# EAGLE design CMoy-Pro-Battery_Holder-V_1_0_0_1a (EAGLE 6.4)
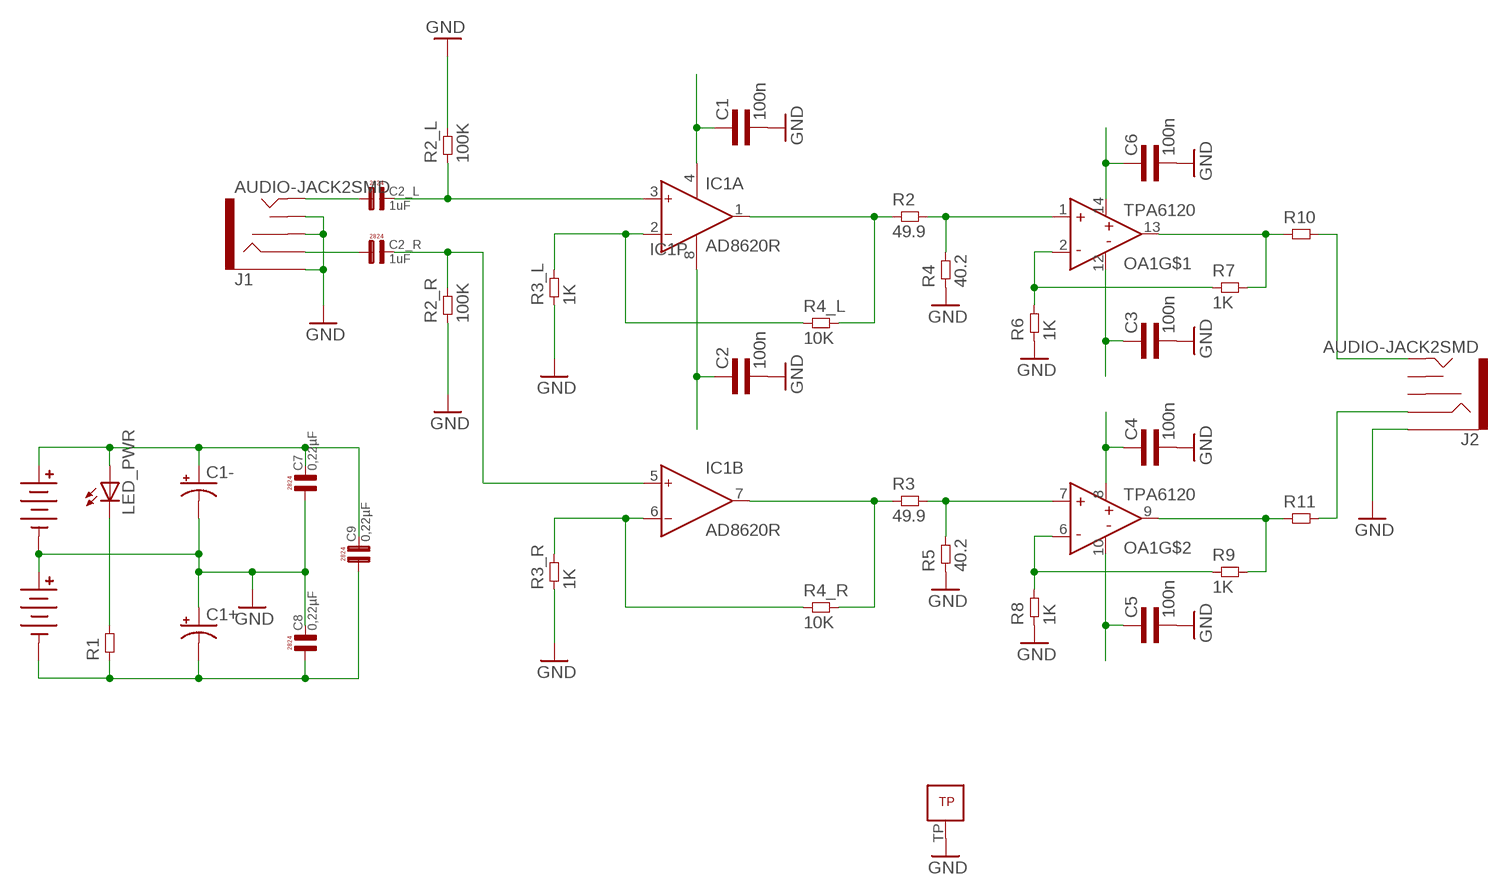
[diagram p0: schematic, sheet 1]

## Parts
BATT1  BATT_9V  [9V_FEMALE]
BATT2  BATT_9V  [9V_FEMALE]
C1  100n  CAP0603L3  [0603L3]
C1+  CPOL-US140CLH-1010  [140CLH-1010]
C1-  CPOL-US140CLH-1010  [140CLH-1010]
C2  100n  CAP0603L3  [0603L3]
C2_L  1uF  1,0µF  [L7,2]
C2_R  1uF  1,0µF  [L7,2]
C3  100n  CAP0603L3  [0603L3]
C4  100n  CAP0603L3  [0603L3]
C5  100n  CAP0603L3  [0603L3]
C6  100n  CAP0603L3  [0603L3]
C7  0,22µF  [L7,2]
C8  0,22µF  [L7,2]
C9  0,22µF  [L7,2]
IC1  AD8620R  [SO8]
J1  AUDIO-JACK2SMD  [AUDIO-JACK-3.5MM-SMD]
J2  AUDIO-JACK2SMD  [AUDIO-JACK-3.5MM-SMD]
LED_PWR  LEDCHIP-LED0603  [CHIP-LED0603]
OA1  TPA6120QFN  [S-PVQFN-N14]
R1  RES0603L3  [0603L3]
R2  49.9  RES0603L3  [0603L3]
R2_L  100K  RES0603L3  [0603L3]
R2_R  100K  RES0603L3  [0603L3]
R3  49.9  RES0603L3  [0603L3]
R3_L  1K  RES0603L3  [0603L3]
R3_R  1K  RES0603L3  [0603L3]
R4  40.2  RES0603L3  [0603L3]
R4_L  10K  RES0603L3  [0603L3]
R4_R  10K  RES0603L3  [0603L3]
R5  40.2  RES0603L3  [0603L3]
R6  1K  RES0603L3  [0603L3]
R7  1K  RES0603L3  [0603L3]
R8  1K  RES0603L3  [0603L3]
R9  1K  RES0603L3  [0603L3]
R10  RES1206L3  [1206L3]
R11  RES1206L3  [1206L3]

## Nets
GND: BATT1.N1(NEG) BATT1.N2(NEG) BATT1.N3(NEG) BATT2.P1(POS) BATT2.P2(POS) BATT2.P3(POS) C1+.+ C1-.- C1.P$2 C2.P$2 C3.P$2 C4.P$2 C5.P$2 C6.P$2 C7.P$1 C8.P$2 J1.RSH J1.SLEEVE J1.TSH J2.SLEEVE OA1.TP R2_L.P$2 R2_R.P$1 R3_L.P$1 R3_R.P$1 R4.P$1 R5.P$1 R6.P$1 R8.P$1
HP_L: C2_R.P$1 J1.RING
HP_R: C2_L.P$1 J1.TIP
IN_L: C2_R.P$2 IC1.5(B:IN+) R2_R.P$2
IN_R: C2_L.P$2 IC1.3(A:IN+) R2_L.P$1
N$1: LED_PWR.C R1.P$2
N$2: OA1.1(IN+) R2.P$2 R4.P$2
N$3: OA1.7(IN+) R3.P$2 R5.P$2
N$4: OA1.2(IN-) R6.P$2 R7.P$1
N$5: IC1.2(A:IN-) R3_L.P$2 R4_L.P$1
N$6: IC1.6(B:IN-) R3_R.P$2 R4_R.P$1
N$7: OA1.13(OUT) R7.P$2 R10.1
N$8: OA1.6(IN-) R8.P$2 R9.P$1
N$9: OA1.9(OUT) R9.P$2 R11.1
N$10: J2.TIP R10.2
N$11: J2.RING R11.2
OUT_L: IC1.1(A:OUT) R2.P$1 R4_L.P$2
OUT_R: IC1.7(B:OUT) R3.P$1 R4_R.P$2
V+: BATT1.P1(POS) BATT1.P2(POS) BATT1.P3(POS) C1-.+ C2.P$1 C4.P$1 C6.P$1 C7.P$2 C9.P$2 IC1.8(P:V+) LED_PWR.A OA1.8(V+) OA1.14(V+)
V-: BATT2.N1(NEG) BATT2.N2(NEG) BATT2.N3(NEG) C1+.- C1.P$1 C3.P$1 C5.P$1 C8.P$1 C9.P$1 IC1.4(P:V-) OA1.10(V-) OA1.12(V-) R1.P$1
Unconnected: J2.RSH J2.TSH

## Library data of the parts
BATT1 BATT2 = common:BATT_9V: 9V Battery
C1-C6 = common:CAP
C1+ C1- = rcl:CPOL-US: POLARIZED CAPACITOR, American symbol
C2_L C2_R = Capacitor-Wima-SMD2824-63v:1,0µF
C7-C9 = Capacitor-Wima-SMD2824-63v:0,22µF
IC1 = analog-devices:AD8620: Precision, Very Low Noise, Low Input Bias Current, Wide Bandwidth JFET Operational Amplifiers Source: http://www.analog.com/static/imported-files/data_sheets/AD8610_8620.pdf; MF: ALTERA CORPORATION; MPN: AD8620ARZ; OC_FARNELL: 9994386; OC_NEWARK: 59K6972
J1 J2 = SparkFun-Connectors:AUDIO-JACK2: Stereo audio jack with bypass switches. Used on LilyPad MP3 board. Production SKU: CONN-10353; PROD_ID: CONN-10353
LED_PWR = adafruit:LED: LED OSRAM: - CHIPLED LG R971, LG N971, LY N971, LG Q971, LY Q971, LO R971, LY R971 LH N974, LH R974 LS Q976, LO Q976, LY Q976 LO Q996 - Hyper CHIPLED LW Q18S LB Q993, LB Q99A, LB R99A - SideLED LS A670, LO A670, LY A670, LG A670, LP A670 LB A673, LV A673, LT A673, LW A673 LH A674 LY A675 LS A676, LA A676, LO A676, LY A676, LW A676 LS A679, LY A679, LG A679 - Hyper Micro SIDELED® LS Y876, LA Y876, LO Y876, LY Y876 LT Y87S - SmartLED LW L88C, LW L88S LB L89C, LB L89S, LG L890 LS L89K, LO L89K, LY L89K LS L896, LA L896, LO L896, LY L896 - TOPLED LS T670, LO T670, LY T670, LG T670, LP T670 LSG T670, LSP T670, LSY T670, LOP T670, LYG T670 LG T671, LOG T671, LSG T671 LB T673, LV T673, LT T673, LW T673 LH T674 LS T676, LA T676, LO T676, LY T676, LB T676, LH T676, LSB T676, LW T676 LB T67C, LV T67C, LT T67C, LS T67K, LO T67K, LY T67K, LW E67C LS E67B, LA E67B, LO E67B, LY E67B, LB E67C, LV E67C, LT E67C LW T67C LS T679, LY T679, LG T679 LS T770, LO T770, LY T770, LG T770, LP T770 LB T773, LV T773, LT T773, LW T773 LH T774 LS E675, LA E675, LY E675, LS T675 LS T776, LA T776, LO T776, LY T776, LB T776 LHGB T686 LT T68C, LB T68C - Hyper Mini TOPLED® LB M676 - Mini TOPLED Santana® LG M470 LS M47K, LO M47K, LY M47K Source: http://www.osram.convergy.de/
OA1 = common:TPA6120
R1 R2 R2_L R2_R R3 R3_L R3_R R4 R4_L R4_R R5-R11 = common:RES

## Board
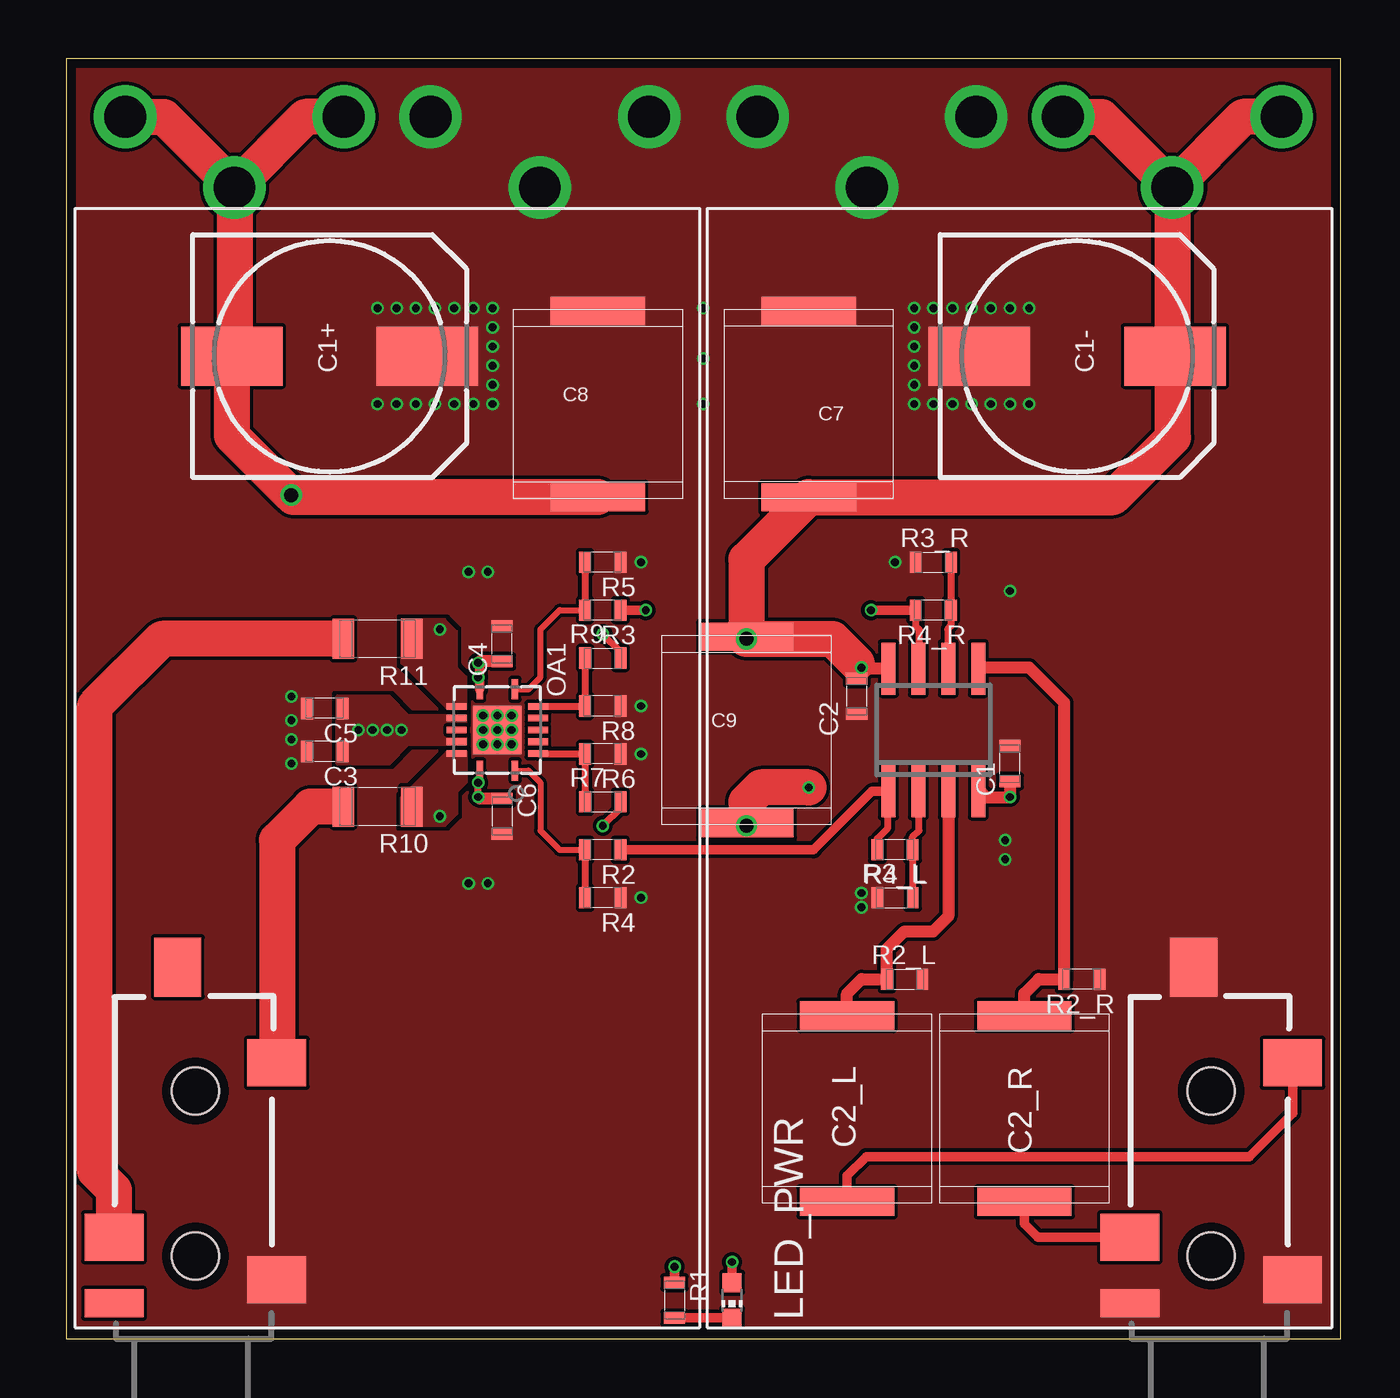
[diagram p1: board, top side]
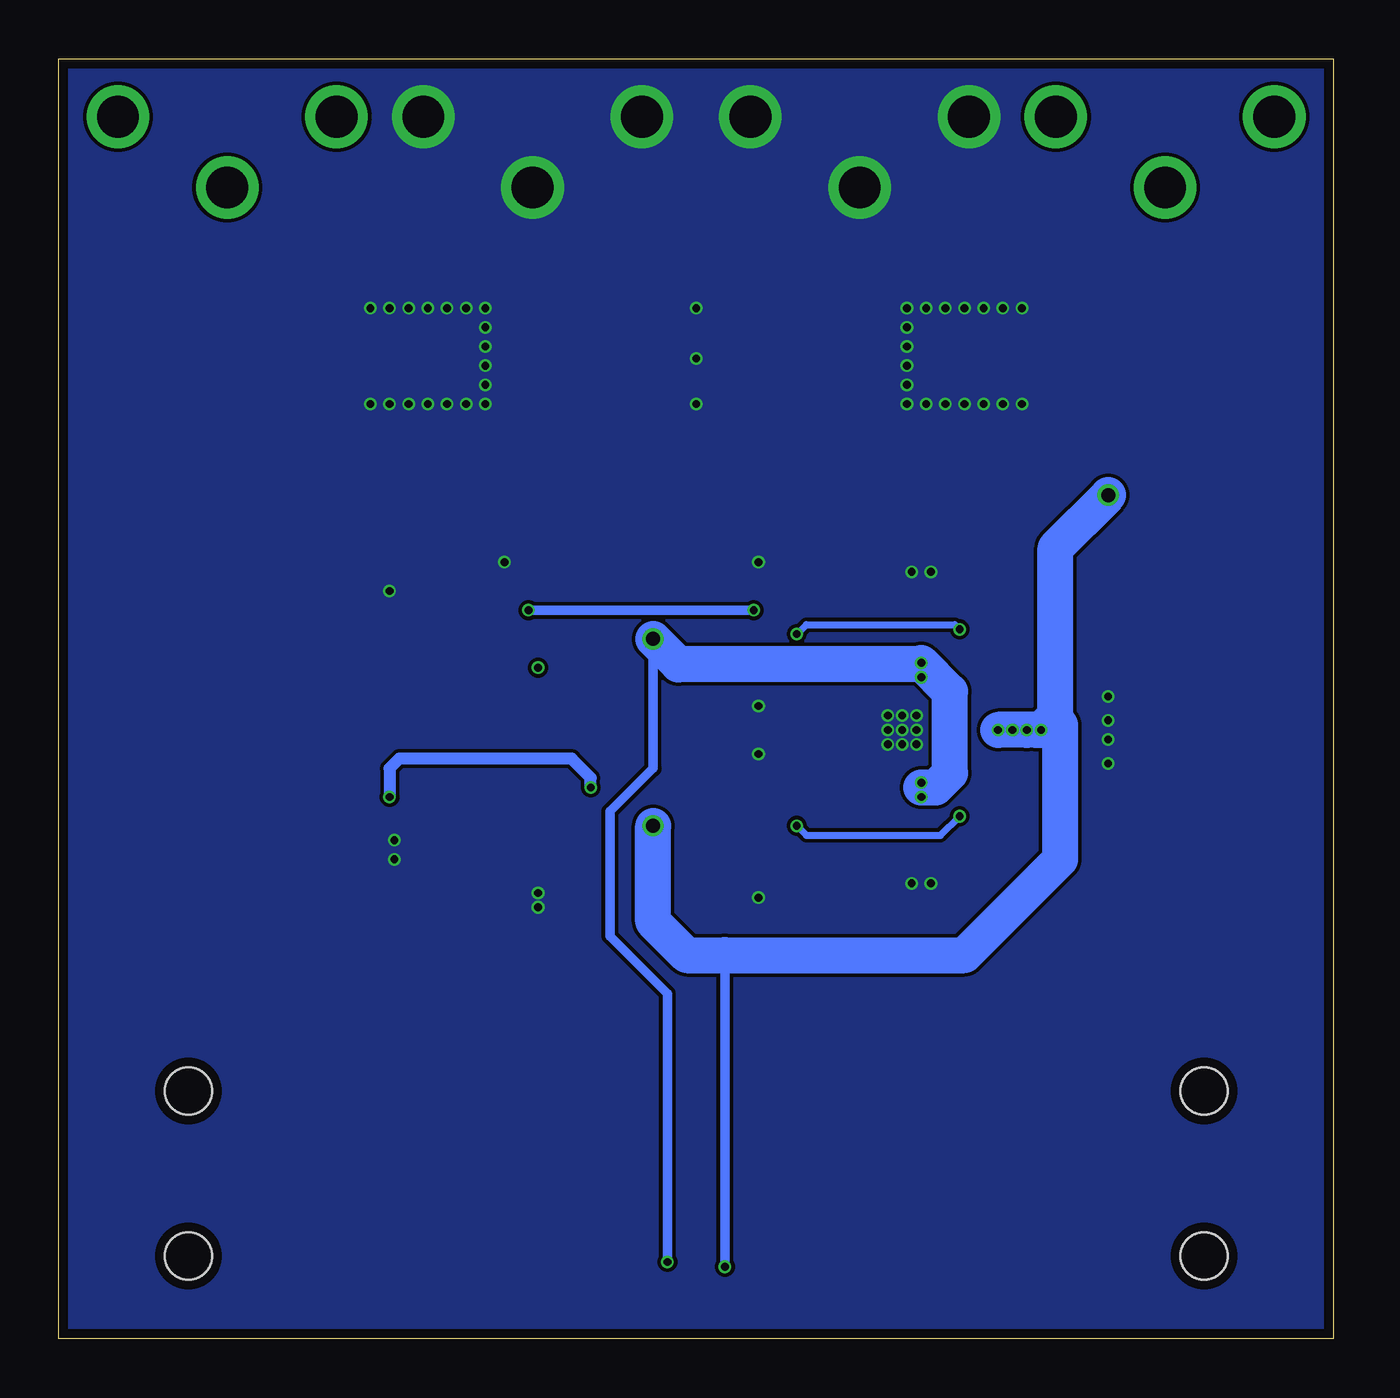
[diagram p2: board, bottom side, seen from below]

Size 54.05 x 54.25 mm. Coordinates in mm from the lower left corner, seen from the top.
Outline: 0,0 54.05,0 54.05,54.25 0,54.25 0,0
Copper layers (1*16): Top 0.035mm / dielectric 1.5mm / Bottom 0.035mm
Design rules "default *": minimum track width 6mil, minimum drill 10mil, track to track 6mil, track to pad 6mil, pad to pad 6mil, via to via 6mil, smd to smd 6mil, copper to edge 16mil, drill to drill 8mil, minimum pad ring 4mil, minimum via ring 4mil, stop-mask expansion 4mil, vias tented up to drill 24mil, thermal gap 10mil

### Footprints (pad centres in the part's own frame; a part is rotated, then mirrored left to right if it is on the bottom)
9V_FEMALE = drill 1.77: N1 -11.11,26.2; N2 -6.475,23.2; N3 -1.84,26.2; P1 1.84,26.2; P2 6.475,23.2; P3 11.11,26.2
0603L3 = smd 0.5 x 0.9: P$1 -0.75,0; P$2 0.75,0
140CLH-1010 = smd 4.3 x 2.5: + 4.15,0; - -4.15,0
L7,2 = smd 4 x 1.2: P$1 0,-3.95; P$2 0,3.95
SO8 = smd 0.6 x 2.2: 1 -1.905,-2.6; 2 -0.635,-2.6; 3 0.635,-2.6; 4 1.905,-2.6; 5 1.905,2.6; 6 0.635,2.6; 7 -0.635,2.6; 8 -1.905,2.6
AUDIO-JACK-3.5MM-SMD = smd 2 x 2.5: RING 4.3,3.45; SLEEVE 2.5,-3.45; TIP 11.7,-3.45 | smd 1.2 x 2.5: RSH 1.5,3.45 | smd 2.5 x 2: TSH 15.75,0.75 | hole 2: 3.5,0; 10.5,0
CHIP-LED0603 = smd 0.8 x 0.8: A 0,-0.75; C 0,0.75
S-PVQFN-N14 = smd 0.85 x 0.28: 1 -1.725,-0.75; 7 1.725,-0.75; 8 1.725,0.75; 14 -1.725,0.75 | smd 0.28 x 0.85: 2 -1,-1.725; 3 -0.5,-1.725; 4 0,-1.725; 5 0.5,-1.725; 6 1,-1.725; 9 1,1.725; 10 0.5,1.725; 11 0,1.725; 12 -0.5,1.725; 13 -1,1.725 | smd 2.05 x 2.05: TP 0,0
1206L3 = smd 0.9 x 1.7: 1 -1.45,0; 2 1.45,0

### Placement (x,y rotation side)
BATT1  40.44,25.6 0 top
BATT2  13.61,25.6 0 top
C1  40.03,24.38 90 top
C1+  11.18,41.66 0 top
C1-  42.88,41.66 0 top
C2  33.53,27.23 270 top
C2_L  33.12,9.75 0 top
C2_R  40.64,9.75 0 top
C3  10.97,24.89 180 top
C4  18.49,29.46 90 top
C5  10.97,26.72 180 top
C6  18.49,22.15 270 top
C7  31.5,39.62 180 top
C8  22.56,39.62 0 top
C9  28.85,25.81 0 top
IC1  36.78,25.81 0 top
J1  48.56,0 90 top
J2  5.49,0 90 top
LED_PWR  28.24,1.63 180 top
OA1  18.29,25.81 90 top
R1  25.81,1.63 270 top
R2  22.76,20.73 180 top
R2_L  35.56,15.24 0 top
R2_R  43.08,15.24 180 top
R3  22.76,30.89 180 top
R3_L  35.15,18.69 0 top
R3_R  36.78,32.92 0 top
R4  22.76,18.69 180 top
R4_L  35.15,20.73 180 top
R4_R  36.78,30.89 180 top
R5  22.76,32.92 180 top
R6  22.76,24.79 180 top
R7  22.76,22.76 0 top
R8  22.76,26.82 180 top
R9  22.76,28.85 0 top
R10  13.21,22.56 180 top
R11  13.21,29.67 180 top

### Tracks (layer width: path | path; a pad name or v marks a point on that pad's centre or on a via)
GND  (via drill 0.33)
  other vias: 18.9,26.42 18.9,25.81 18.9,25.2 18.29,26.42 17.68,26.42 18.29,25.81 17.68,25.81 18.29,25.2 17.68,25.2 13.21,39.62 14.02,39.62 14.83,39.62 15.65,39.62 16.46,39.62 17.27,39.62 18.08,39.62 18.08,40.44 18.08,41.25 18.08,42.06 18.08,42.88 18.08,43.69 17.27,43.69 16.46,43.69 15.65,43.69 14.83,43.69 14.02,43.69 13.21,43.69 40.84,39.62 40.03,39.62 39.22,39.62 38.4,39.62 37.59,39.62 36.78,39.62 35.97,39.62 35.97,40.44 35.97,41.25 35.97,42.06 35.97,42.88 35.97,43.69 36.78,43.69 37.59,43.69 38.4,43.69 39.22,43.69 40.03,43.69 40.84,43.69 27.03,43.69 27.03,39.62 27.03,41.55 24.38,32.92 24.38,26.82 24.38,24.79 24.38,18.69 35.15,32.92 33.73,18.9 39.83,21.13 40.03,31.7 17.07,19.3 17.88,19.3 17.07,32.51 17.88,32.51 9.55,25.4 9.55,24.38 9.55,26.21 9.55,27.23 33.73,18.29 39.83,20.32
  pour Top (rank 6, no thermals): 53.64,53.85 53.64,0.41 0.41,0.41 0.41,53.85
  pour Bottom (rank 6, no thermals): 53.64,53.85 53.64,0.41 0.41,0.41 0.41,53.85
HP_L
  Top 0.406: J1.RING 41.22,4.3 40.64,4.88 C2_R.P$1
HP_R
  Top 0.406: J1.TIP 52.02,9.55 50.19,7.72 33.93,7.72 33.12,6.91 C2_L.P$1
IN_L
  Top 0.508: IC1.5 38.73,28.45 40.84,28.45 42.33,26.96 R2_R.P$2 41.25,15.24 40.64,14.63 C2_R.P$2
IN_R
  Top 0.508: C2_L.P$2 33.12,14.63 33.73,15.24 R2_L.P$1 34.81,16.52 35.56,17.27 36.78,17.27 37.41,17.91 IC1.3
N$1
  Top 0.406: R1.P$2 LED_PWR.C
N$2
  Top 0.254: OA1.1 19.61,24.08 20.12,23.57 20.12,21.54 20.93,20.73 R2.P$2
  Top 0.305: R2.P$2 R4.P$2
N$3
  Top 0.254: OA1.7 19.61,27.53 20.12,28.04 20.12,30.07 20.93,30.89 R3.P$2
  Top 0.305: R5.P$2 R3.P$2
N$4
  Top 0.305: R7.P$1 R6.P$2 21.99,24.81 OA1.2
N$5
  Top 0.305: IC1.2 36.17,23.18 36.17,21.54 35.9,21.27 R4_L.P$1 R3_L.P$2
N$6
  Top 0.305: IC1.6 37.39,28.43 37.39,30.07 37.53,30.21 R4_R.P$1 R3_R.P$2
N$7  (via drill 0.33)
  Top 0.305: R7.P$2 23.51,22.49 v22.76,21.74
  Bottom 0.305: v22.76,21.74 22.35,21.34 16.66,21.34 v15.85,22.15
  pour Top (no thermals): 16.97,24.89 16.97,23.57 16.56,23.16 16.56,22.25 16.05,21.74 14.22,21.74 14.22,22.96 16.15,24.89
N$8
  Top 0.305: R9.P$1 R8.P$2 21.99,26.81 OA1.6
N$9  (via drill 0.33)
  Top 0.305: R9.P$2 23.51,29.12 v22.76,29.87
  Bottom 0.305: v22.76,29.87 22.35,30.28 16.05,30.28 v15.85,30.07
  pour Top (no thermals): 16.97,26.72 16.97,28.04 16.56,28.45 16.56,29.97 16.05,30.48 14.22,30.48 14.22,28.65 16.15,26.72
N$10
  Top 0.406: R10.2 11.38,22.56
  Top 1.524: J2.TIP 8.94,21.13 10.36,22.56 11.38,22.56
N$11
  Top 0.406: R11.2 11.38,29.67
  Top 1.524: J2.RING 2.03,6.3 1.22,7.11 1.22,26.82 4.06,29.67 11.38,29.67
OUT_L
  Top 0.305: R4_L.P$2 34.4,21.2 34.85,21.64 34.85,23.18 IC1.1
  Top 0.406: IC1.1 34.18,23.21 31.7,20.73 R2.P$1
OUT_R  (via drill 0.33)
  Top 0.305: R4_R.P$2 36.03,30.21 36.17,30.07 36.17,28.43 IC1.7
  Top 0.406: R4_R.P$2 v34.14,30.89 | v24.59,30.89 R3.P$1
  Bottom 0.406: v34.14,30.89 v24.59,30.89
V+  (via drill 0.33, 0.6)
  Top 0.305: OA1.8 17.54,27.98 v17.48,28.04 | OA1.14 17.54,23.63 v17.48,23.57 v17.48,22.96
  Top 0.406: OA1.8 17.54,28.59 v17.48,28.65 | 33.63,28.35 v33.73,28.45 | LED_PWR.A v28.24,3.25
  Top 0.508: IC1.8 33.77,28.41 v33.73,28.45 33.53,28.65 | C2.P$1 33.53,28.24 33.63,28.35 | C4.P$1 17.54,28.71 v17.48,28.65 | C6.P$1 17.54,22.9 v17.48,22.96 | 28.85,30.28 C9.P$2 v28.85,29.67
  Top 1.524: BATT1.P1 43.91,51.8 BATT1.P2 | BATT1.P3 49.91,51.8 BATT1.P2 | BATT1.P2 46.91,41.86 | 46.91,41.86 46.91,41.77 C1-.+ | 46.91,41.86 46.94,41.83 46.94,38.2 44.41,35.67 C7.P$2 28.85,33.03 28.85,30.28 | v28.85,29.67 32.51,29.67 33.53,28.65
  Bottom 0.305: 17.48,23.37 v17.48,23.57
  Bottom 0.406: v28.24,3.25 28.24,14.63 30.68,17.07 30.68,22.35 28.85,24.18 v28.85,29.67
  Bottom 1.524: 17.48,23.37 16.87,23.37 16.26,23.98 16.26,27.43 v17.48,28.65 17.54,28.59 27.78,28.59 v28.85,29.67
V-  (via drill 0.33, 0.6)
  Top 0.406: R1.P$1 v25.81,3.05
  Top 0.508: IC1.4 38.77,23.21 39.01,22.96 v40.03,22.96 C1.P$1 | 28.85,22.35 C9.P$1 v28.85,21.74
  Top 1.524: BATT2.N1 4.14,51.8 BATT2.N2 | BATT2.N3 10.14,51.8 BATT2.N2 | BATT2.N2 7.14,41.77 C1+.- 7.03,38.29 v9.55,35.76 9.64,35.67 C8.P$1 | v31.5,23.37 29.46,23.37 28.85,22.76 28.85,22.35
  Bottom 0.406: v25.81,3.05 25.81,16.26
  Bottom 0.508: v31.5,23.37 31.5,23.77 32.31,24.59 39.62,24.59 40.03,24.18 v40.03,22.96
  Bottom 1.524: 12.6,25.81 v13.01,25.81 v14.22,25.81 | 11.89,26.31 11.79,26.42 11.79,33.53 v9.55,35.76 | 11.89,26.31 v12.39,25.81 | 11.89,26.31 11.58,26.01 11.58,20.32 15.65,16.26 25.81,16.26 27.43,16.26 28.85,17.68 v28.85,21.74
  other vias: 13.61,25.81
  pour Top (no thermals): 16.97,26.42 14.53,26.42 13.72,27.23 11.48,27.23 11.48,24.38 13.72,24.38 14.53,25.2 16.97,25.2